# Altium schematic sheet Sheet1.SchDoc
size A3; SheetNumber: 1; SheetTotal: 1
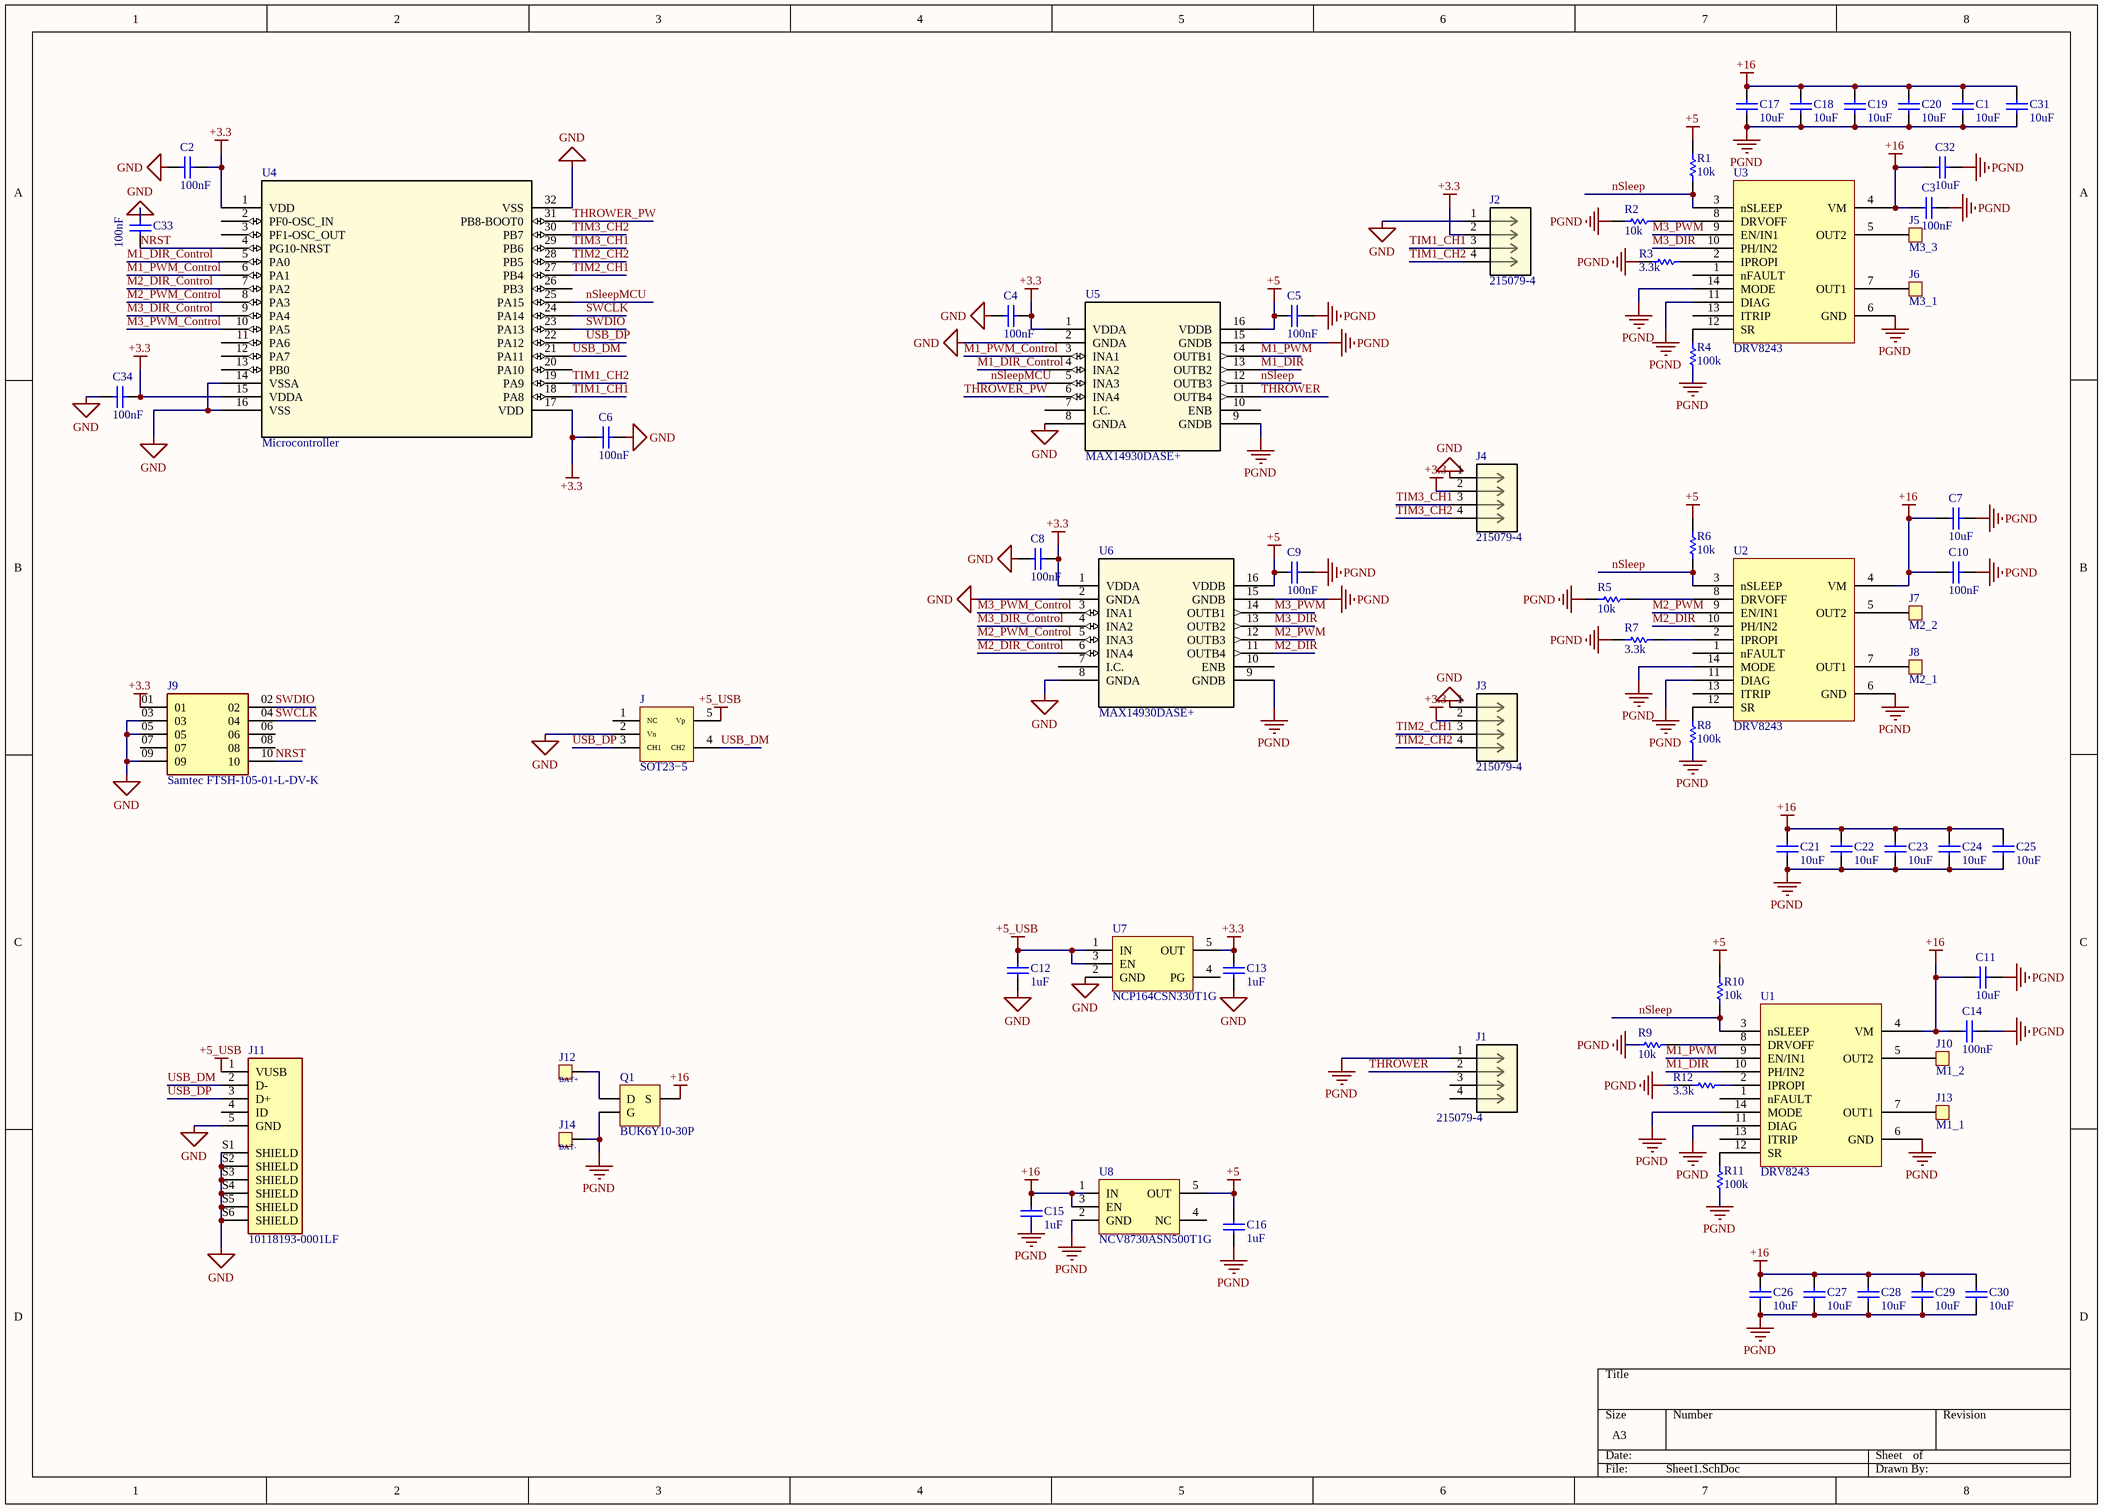
[diagram p0: Sheet1.SchDoc]

## Parts
C1  value 10uF  [CAPC1206(3216)190_N]  (hidden comment: CAP 10uF)
C2  100nF  [CAPC1608X90X35LL15T15]
C3  100nF  [CAPC1608X90X35LL15T15]
C4  100nF  [CAPC1608X90X35LL15T15]
C5  100nF  [CAPC1608X90X35LL15T15]
C6  100nF  [CAPC1608X90X35LL15T15]
C7  value 10uF  [CAPC1206(3216)190_N]  (hidden comment: CAP 10uF)
C8  100nF  [CAPC1608X90X35LL15T15]
C9  100nF  [CAPC1608X90X35LL15T15]
C10  100nF  [CAPC1608X90X35LL15T15]
C11  value 10uF  [CAPC1206(3216)190_N]  (hidden comment: CAP 10uF)
C12  1uF  [CAPC1608X90X35LL15T15]
C13  1uF  [CAPC1608X90X35LL15T15]
C14  100nF  [CAPC1608X90X35LL15T15]
C15  1uF  [CAPC1608X90X35LL15T15]
C16  1uF  [CAPC1608X90X35LL15T15]
C17  value 10uF  [CAPC1206(3216)190_N]  (hidden comment: CAP 10uF)
C18  value 10uF  [CAPC1206(3216)190_N]  (hidden comment: CAP 10uF)
C19  value 10uF  [CAPC1206(3216)190_N]  (hidden comment: CAP 10uF)
C20  value 10uF  [CAPC1206(3216)190_N]  (hidden comment: CAP 10uF)
C21  value 10uF  [CAPC1206(3216)190_N]  (hidden comment: CAP 10uF)
C22  value 10uF  [CAPC1206(3216)190_N]  (hidden comment: CAP 10uF)
C23  value 10uF  [CAPC1206(3216)190_N]  (hidden comment: CAP 10uF)
C24  value 10uF  [CAPC1206(3216)190_N]  (hidden comment: CAP 10uF)
C25  value 10uF  [CAPC1206(3216)190_N]  (hidden comment: CAP 10uF)
C26  value 10uF  [CAPC1206(3216)190_N]  (hidden comment: CAP 10uF)
C27  value 10uF  [CAPC1206(3216)190_N]  (hidden comment: CAP 10uF)
C28  value 10uF  [CAPC1206(3216)190_N]  (hidden comment: CAP 10uF)
C29  value 10uF  [CAPC1206(3216)190_N]  (hidden comment: CAP 10uF)
C30  value 10uF  [CAPC1206(3216)190_N]  (hidden comment: CAP 10uF)
C31  value 10uF  [CAPC1206(3216)190_N]  (hidden comment: CAP 10uF)
C32  10uF  [CAPC1608X90X35LL15T15]
C33  100nF  [CAPC1608X90X35LL15T15]
C34  100nF  [CAPC1608X90X35LL15T15]
J  SOT23−5  [CM1223-02SO]
J1  215079-4  [Micro-MaTch 215079-4]
J2  215079-4  [Micro-MaTch 215079-4]
J3  215079-4  [Micro-MaTch 215079-4]
J4  215079-4  [Micro-MaTch 215079-4]
J5  M3_3  [J]
J6  M3_1  [J]
J7  M2_2  [J]
J8  M2_1  [J]
J9  Samtec FTSH-105-01-L-DV-K  [Samtec FTSH-105-01-L-DV-K]
J10  M1_2  [J]
J11  10118193-0001LF  [Amphenol 10118193-0001LF]
J12  (no value)  [J]
J13  M1_1  [J]
J14  (no value)  [J]
Q1  BUK6Y10-30P  [BUK6Y10-30P]
R1  Resistance: 10k  [RESC1609X55X30LL15T15]  (hidden comment: ERJ3EKF1002V)
R2  Resistance: 10k  [RESC1609X55X30LL15T15]  (hidden comment: ERJ3EKF1002V)
R3  3.3k  [RESC1608X55X30ML20T20]
R4  100k  [RESC1608X55X30ML20T20]
R5  Resistance: 10k  [RESC1609X55X30LL15T15]  (hidden comment: ERJ3EKF1002V)
R6  Resistance: 10k  [RESC1609X55X30LL15T15]  (hidden comment: ERJ3EKF1002V)
R7  3.3k  [RESC1608X55X30ML20T20]
R8  100k  [RESC1608X55X30ML20T20]
R9  Resistance: 10k  [RESC1609X55X30LL15T15]  (hidden comment: ERJ3EKF1002V)
R10  Resistance: 10k  [RESC1609X55X30LL15T15]  (hidden comment: ERJ3EKF1002V)
R11  100k  [RESC1608X55X30ML20T20]
R12  3.3k  [RESC1608X55X30ML20T20]
U1  DRV8243  [DRV8243]
U2  DRV8243  [DRV8243]
U3  DRV8243  [DRV8243]
U4  Microcontroller  [STM32G441KB]
U5  MAX14930DASE+  [MAX14930DASE+]
U6  MAX14930DASE+  [MAX14930DASE+]
U7  NCP164CSN330T1G  [NCV8730ASN500T1G]
U8  NCV8730ASN500T1G  [NCV8730ASN500T1G]

## Nets
+3.3: C2.1 C4.1 C6.2 C8.1 C13.1 C34.1 J2.2 J3.2 J4.2 J9.01 U4.1(VDD) U4.15(VDDA) U4.17(VDD) U5.1(VDDA) U6.1(VDDA) U7.5(OUT)
+5: C5.2 C9.2 C16.1 R1.1 R6.1 R10.1 U5.16(VDDB) U6.16(VDDB) U8.5(OUT)
+5_USB: C12.1 J.5(Vp) J11.1(VUSB) U7.1(IN) U7.3(EN)
+16: C1.2 C3.2 C7.1 C10.2 C11.1 C14.2 C15.1 C17.2 C18.2 C19.2 C20.2 C21.2 C22.2 C23.2 C24.2 C25.2 C26.2 C27.2 C28.2 C29.2 C30.2 C31.2 C32.2 Q1.S U1.4(VM) U2.4(VM) U3.4(VM) U8.1(IN) U8.3(EN)
GND: C2.2 C4.2 C6.1 C8.2 C12.2 C13.2 C33.1 C34.2 J.2(Vn) J2.1 J3.1 J4.1 J9.03 J9.05 J9.09 J11.5(GND) J11.S1(SHIELD) J11.S2(SHIELD) J11.S3(SHIELD) J11.S4(SHIELD) J11.S5(SHIELD) J11.S6(SHIELD) U4.14(VSSA) U4.16(VSS) U4.32(VSS) U5.2(GNDA) U5.8(GNDA) U6.2(GNDA) U6.8(GNDA) U7.2(GND)
PGND: C1.1 C3.1 C5.1 C7.2 C9.1 C10.1 C11.2 C14.1 C15.2 C16.2 C17.1 C18.1 C19.1 C20.1 C21.1 C22.1 C23.1 C24.1 C25.1 C26.1 C27.1 C28.1 C29.1 C30.1 C31.1 C32.1 J1.1 J14.1 Q1.G R2.1 R3.1 R4.1 R5.1 R7.1 R8.1 R9.1 R11.1 R12.1 U1.6(GND) U1.11(DIAG) U1.14(MODE) U2.6(GND) U2.11(DIAG) U2.14(MODE) U3.6(GND) U3.11(DIAG) U3.14(MODE) U5.9(GNDB) U5.15(GNDB) U6.9(GNDB) U6.15(GNDB) U8.2(GND)
M1_DIR: U1.10(PH/IN2) U5.13(OUTB2)
M1_DIR_Control: U4.5(PA0) U5.4(INA2)
M1_PWM: U1.9(EN/IN1) U5.14(OUTB1)
M1_PWM_Control: U4.6(PA1) U5.3(INA1)
M2_DIR: U2.10(PH/IN2) U6.11(OUTB4)
M2_DIR_Control: U4.7(PA2) U6.6(INA4)
M2_PWM: U2.9(EN/IN1) U6.12(OUTB3)
M2_PWM_Control: U4.8(PA3) U6.5(INA3)
M3_DIR: U3.10(PH/IN2) U6.13(OUTB2)
M3_DIR_Control: U4.9(PA4) U6.4(INA2)
M3_PWM: U3.9(EN/IN1) U6.14(OUTB1)
M3_PWM_Control: U4.10(PA5) U6.3(INA1)
NRST: C33.2 J9.10 U4.4(PG10-NRST)
nSleep: R1.2 R6.2 R10.2 U1.3(nSLEEP) U2.3(nSLEEP) U3.3(nSLEEP) U5.12(OUTB3)
nSleepMCU: U4.25(PA15) U5.5(INA3)
SWCLK: J9.04 U4.24(PA14)
SWDIO: J9.02 U4.23(PA13)
THROWER: J1.2 U5.11(OUTB4)
THROWER_PW: U4.31(PB8-BOOT0) U5.6(INA4)
TIM1_CH1: J2.3 U4.18(PA8)
TIM1_CH2: J2.4 U4.19(PA9)
TIM2_CH1: J3.3 U4.27(PB4)
TIM2_CH2: J3.4 U4.28(PB5)
TIM3_CH1: J4.3 U4.29(PB6)
TIM3_CH2: J4.4 U4.30(PB7)
USB_DM: J.4(CH2) J11.2(D-) U4.21(PA11)
USB_DP: J.3(CH1) J11.3(D+) U4.22(PA12)
NetJ5_1: J5.1 U3.5(OUT2)
NetJ6_1: J6.1 U3.7(OUT1)
NetJ7_1: J7.1 U2.5(OUT2)
NetJ8_1: J8.1 U2.7(OUT1)
NetJ10_1: J10.1 U1.5(OUT2)
NetJ12_1: J12.1 Q1.D
NetJ13_1: J13.1 U1.7(OUT1)
NetR2_2: R2.2 U3.8(DRVOFF)
NetR3_2: R3.2 U3.2(IPROPI)
NetR4_2: R4.2 U3.12(SR)
NetR5_2: R5.2 U2.8(DRVOFF)
NetR7_2: R7.2 U2.2(IPROPI)
NetR8_2: R8.2 U2.12(SR)
NetR9_2: R9.2 U1.8(DRVOFF)
NetR11_2: R11.2 U1.12(SR)
NetR12_2: R12.2 U1.2(IPROPI)

Not connected (* = marked no-connect by the designer): J 1(NC); J1 3 4; J9 06 07 08; J11 4(ID); U1 1(nFAULT) 13(ITRIP); U2 1(nFAULT) 13(ITRIP); U3 1(nFAULT) 13(ITRIP); U4 2(PF0-OSC_IN) 3(PF1-OSC_OUT) 11(PA6) 12(PA7) 13(PB0) 20(PA10) 26(PB3); U5 7(I.C.) 10(ENB); U6 7(I.C.) 10(ENB); U7 4(PG); U8 4(NC)

## Notes on the sheet
- (near J12) BAT+
- (near J14) BAT-

## Library data of the parts
C1 C7 C11 C17-C31 = CMP-1037-04981-1: CAP 10uF 25V -20% to +80% 1206 (3216 Metric) Thickness 1.9mm SMD; Case-EIA: 1206; Case-Metric: 3216; Tolerance: -20% to +80%; Max Thickness: 1.9 mm; Rated Voltage: 25 V; Technology: SMT
C2-C6 C8-C10 C12-C16 C32-C34 = CMP-2006-02117-1: Manufacturer: AVX Interconnect / Elco; Part Number: 06035C104J4Z2A
J = CM1223-02SO TVS diode array: USB protection
J1 = Micro-MaTch 215079-4_1: Thrower ESC connector
J2-J4 = Micro-MaTch 215079-4_1: Encoder connectors
J5-J8 J10 J12-J14 = J
J9 = Samtec FTSH-105-01-L-DV-K: Programmer connector
J11 = Amphenol 10118193-0001LF: USB connector
Q1 = BUK6Y10-30P: Reverse voltage protection
R1 R2 R5 R6 R9 R10 = CMP-1012-00623-3: Chip Resistor, 10 KOhm, +/- 1%, 0.1 W, -55 to 155 degC, 0603 (1608 Metric), RoHS, Tape and Reel; Manufacturer: Panasonic; Voltage Rating: 75V; Case\/Package: 0603; Power Rating: 100mW; Temperature Coefficient: 100ppm\/degreesC; Number of Pins: 2; Package Reference: 603; Depth: 0.8mm; Mount: SurfaceMount; Package Description: 2-Pin Surface Mount Device, Body 1.6 x 0.85 mm; Datasheet Version: 02/2017; Length: 1.6mm; Lead Free: LeadFree; Height: 0.45mm; Number of Terminations: 2; Max Power Dissipation: 100mW; Min Operating Temperature: -55degC; Datasheet URL: https://industrial.panasonic.com/cdbs/www-data/pdf/RDA0000/AOA0000C304.pdf; Termination: SMD/SMT; Case Code (Metric): 1608; Case Code (Imperial): 0603; Tolerance: 1%; Max Operating Temperature: 155degC; RoHSCompliant: true; Voltage Rating (DC): 75V; Radiation Hardening: No; Packaging: TapeandReel; Composition: ThickFilm; Mounting Technology: SurfaceMount; Manufacturer URL: http://www.panasonic.com/; Width: 0.031inch; REACH SVHC: NoSVHC; Contact Plating: Tin; Military Standard: Not; Package Quantity: 1
R3 R7 R12 = CMP-2000-00040-1: Manufacturer: Panasonic; Part Number: ERA3AEB332V
R4 R8 R11 = CMP-2000-00875-1: Part Number: ERA3AEB104V; Manufacturer: Panasonic
U1-U3 = DRV8243: DRV8243-Q1 Automotive H-Bridge Driver with Integrated Current Sense and Diagnostics
U4 = STM32G441KBT3
U5 U6 = MAX14930DASE+: Isolator. Signals between the microcontroller and motor drivers should go through isolator(s).
U7 = NCP164CSN330T1G: Input: 5V from USB. / Output: 3.3V, >200mA / For powering the microcontroller, encoders, isolators.
U8 = NCV8730ASN500T1G: Input: 4S battery voltage (up to 16.8V) / Output: 5V, >50mA / For powering the isolators, driver pullup resistors.